# Altium project PCB_Project.PrjPcb
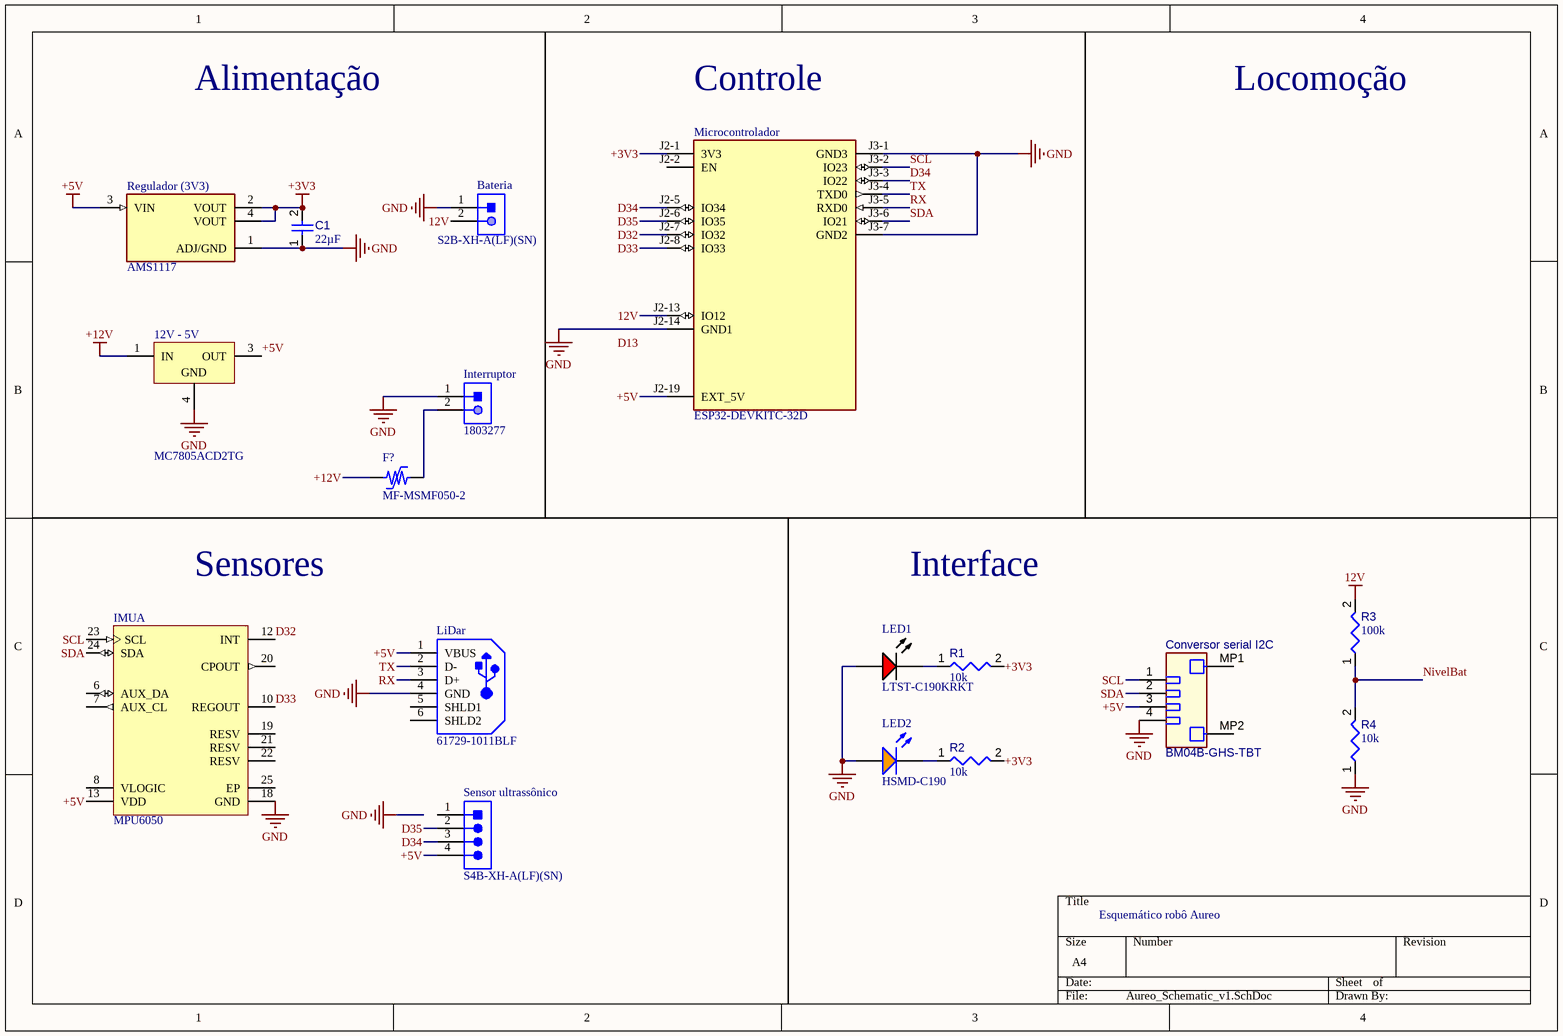
[diagram p0: Aureo_Schematic_v1.SchDoc]
1 sheet, 17 parts. Net scope: global (net labels, ports and power ports of the same name join across sheets).
Board file: Aureo_PCB.PcbDoc

## Sheet Aureo_Schematic_v1.SchDoc
size A4; SheetNumber: 1; SheetTotal: 1

### Parts
12V_-_5V  MC7805ACD2TG  [ONSC-D2PAK-3-936-03_V]
Bateria  S2B-XH-A(LF)(SN)  [JST-S2B-XH-A(LF)(SN)_V]
C1  value 22µF  [CAPC0805(2012)145_L]  (hidden comment: Capacitor 22µF +/-40% 16V 0805)
Conversor_serial_I2C  BM04B-GHS-TBT  [JST-BM04B-GHS-TBT_V]
IMU  MPU6050  [INSE-QFN-24_V]  (part A of 2)
Interruptor  1803277  [PHOE-1803277_V]
LED1  LTST-C190KRKT  [LTST-C191KRKT_V]
LED2  HSMD-C190  [AVAG-HSMX-C190_V]
LiDar  61729-1011BLF  [FCI-61729-1011BLF_V]
Microcontrolador  ESP32-DEVKITC-32D  [MODULE_ESP32-DEVKITC-32D]
R1  value 10k  [RESC1005X40X25ML05T05]  (hidden comment: Resistor 10k +/-1% 0402 100 mW)
R2  value 10k  [RESC1005X40X25ML05T05]  (hidden comment: Resistor 10k +/-1% 0402 100 mW)
R3  value 100k  [RESC1005X40X25ML05T05]  (hidden comment: Resistor 10k +/-1% 0402 100 mW)
R4  value 10k  [RESC1005X40X25ML05T05]  (hidden comment: Resistor 10k +/-1% 0402 100 mW)
Regulador_(3V3)  AMS1117  [SOT229P700X180-4N]
Sensor  MF-MSMF050-2  [BOUR-MF-MSMF050-2_V]
Sensor_ultrassônico  S4B-XH-A(LF)(SN)  [JST-S4B-XH-A(LF)(SN)_V]

### Nets
12V: Bateria.2 Microcontrolador.J2-13(IO12) R3.2
+3V3: C1.2 Microcontrolador.J2-1(3V3) R1.2 R2.2 Regulador_(3V3).2(VOUT) Regulador_(3V3).4(VOUT)
+5V: 12V_-_5V.3(OUT) Conversor_serial_I2C.3 IMU.13(VDD) LiDar.1(VBUS) Microcontrolador.J2-19(EXT_5V) Regulador_(3V3).3(VIN) Sensor_ultrassônico.4
+12V: 12V_-_5V.1(IN) Sensor.1
GND: 12V_-_5V.4(GND) Bateria.1 C1.1 Conversor_serial_I2C.4 IMU.18(GND) Interruptor.1 LED1.1(A) LED2.1(A) LiDar.4(GND) Microcontrolador.J2-14(GND1) Microcontrolador.J3-1(GND3) Microcontrolador.J3-7(GND2) R4.1 Regulador_(3V3).1(ADJ/GND)
D32: IMU.12(INT) Microcontrolador.J2-7(IO32)
D33: IMU.10(REGOUT) Microcontrolador.J2-8(IO33)
D34: Microcontrolador.J2-5(IO34) Microcontrolador.J3-3(IO22) Sensor_ultrassônico.3
D35: Microcontrolador.J2-6(IO35) Sensor_ultrassônico.2
NivelBat: R3.1 R4.2
RX: LiDar.3(D+) Microcontrolador.J3-5(RXD0)
SCL: Conversor_serial_I2C.1 IMU.23(SCL) Microcontrolador.J3-2(IO23)
SDA: Conversor_serial_I2C.2 IMU.24(SDA) Microcontrolador.J3-6(IO21)
TX: LiDar.2(D-) Microcontrolador.J3-4(TXD0)
NetInterruptor_2: Interruptor.2 Sensor.2
NetLED1_2: LED1.2(K) R1.1
NetLED2_2: LED2.2(K) R2.1

Not connected (* = marked no-connect by the designer): Conversor_serial_I2C MP1 MP2; IMU 6(AUX_DA) 7(AUX_CL) 8(VLOGIC) 19(RESV) 20(CPOUT) 21(RESV) 22(RESV) 25(EP); LiDar 5(SHLD1) 6(SHLD2); Microcontrolador J2-2(EN) J2-3(SENSOR_VP) J2-4(SENSOR_VN) J2-9(IO25) J2-10(IO26) J2-11(IO27) J2-12(IO14) J2-15(IO13) J2-16(SD2) J2-17(SD3) J2-18(CMD) J3-8(IO19) J3-9(IO18) J3-10(IO5) J3-11(IO17) J3-12(IO16) J3-13(IO4) J3-14(IO0) J3-15(IO2) J3-16(IO15) J3-17(SD1) J3-18(SD0) J3-19(CLK); Sensor_ultrassônico 1

### Notes on the sheet
- Alimentação
- Controle
- Locomoção
- Sensores
- Interface
- Esquemático robô Aureo
- Labels drawn without touching a wire or pin: D13

### Library data of the parts
12V_-_5V = CMP-019-00027-3: Positive Voltage Regulator, 5 V Output Voltage, 1 A, 0 to 125 degC, 3-Pin D2PAK (936-03), Pb-Free, Tube; Manufacturer: ON Semiconductor; Min Input Voltage: 7V; Package Version: Rev. E, 09/2015; Output Voltage: 5V; Outputs: 1; Max Input Voltage: 35V; Output Current: 1A; Dropout Voltage: 2V; Mounting Technology: SM; Package Quantity: 50; Manufacturer URL: http://www.onsemi.com/; Package Reference: D2PAK-3-936-03; Nominal Output Voltage: 5V; Packaging: Rail/Tube; Max Operating Temperature: 125°C; Datasheet URL: http://www.onsemi.com/pub_link/Collateral/MC7800-D.PDF; RoHS Compliant: True; Datasheet Version: Rev. 27, 11/2014; Case/Package: TO-263-3; Min Operating Temperature: 0°C; Max Ouput Current: 1A; Package Description: 3-Pin Flange Mount, Body 10.02 x 9.1945 mm, Pitch 2.54 mm; Package URL: http://www.onsemi.com/pub_link/Collateral/936-03.PDF; Pins: 3
Bateria = CMP-002-00032-2: Male Header, Pitch 2.5 mm, 1 x 2 Position, Height 6.1 mm, Tail Length 3.4 mm, -25 to 85 degC, RoHS, Bulk; Manufacturer: JST; Case/Package: S2B-XH-A(LF)(SN); Package Description: XH Series Disconnectable Crimp Style Connector, Pitch 2.5 mm, 1 x 2 Position, Height 6.1 mm, Tail Length 3.4 mm; Manufacturer URL: http://www.jst.com/home2.html; Datasheet URL: http://www.jst-mfg.com/product/pdf/eng/eXH.pdf; Connector Type: Header; Package Reference: S2B-XH-A(LF)(SN); Mounting Technology: TH; Max Operating Temperature: 85°C; Min Operating Temperature: -25°C; Datasheet Version: May-16; Gender: Male; RoHS Compliant: Unknown
C1 = CMP-001-00081-4: Chip Capacitor, 22µF +/-40%, 16V, 0805, Thickness 1.45 mm; Tolerance: 5%; Voltage Rating: 16V; Mounting Technology: SMT; Pins: 2; Max Operating Temperature: 85°C; Case/Package: 0805; Min Operating Temperature: -55°C
Conversor_serial_I2C = CMP-002-00053-3: Header, Pitch 1.25 mm, 1 x 4 Position, Height 4.05 mm, -25 to 85 degC; Pins: 6
IMU = CMP-010-00014-3: 3-Axis Gyroscope, 3-Axis Accelerometer, 2.375 to 3.46 V, -40 to 105 degC, 24-Pin QFN, RoHS, Tape and Reel; Manufacturer: InvenSense; Max Supply Voltage: 3.6V; Min Supply Voltage: 2.5V; Sensor Type: Motion; Interface: I2C; Min Operating Temperature: -40°C; Case/Package: QFN; Package Quantity: 5000; Pins: 24; RoHS Compliant: True; Packaging: CutTape; Datasheet URL: https://datasheet.ciiva.com/1513/1788002-1513632.pdf; Package Reference: QFN-24; Datasheet Version: Rev. 3.4, 08/2013; Package Description: 24-Pin Quad Flat No-lead Package, Body 4 x 4 mm, Pitch 0.5 mm; Max Operating Temperature: 85°C; Mounting Technology: SM
Interruptor = CMP-002-00014-2: Male Header, Pitch 3.81 mm, 1 x 2 Position, Height 7.25 mm, Tail Length 3.4 mm, RoHS, Bulk; Manufacturer: Phoenix Contact; Voltage Rating: 160V; Current Rating: 8A; Rows: 1; Mounting Technology: TH; Contact Plating: Tin; Case/Package: 1803277; Gender: Male; Diameter: 7.25mm; Datasheet Version: Feb-14; Colour: Green; Pins: 2; Lead Pitch: 0.15inch; Connector Type: Header; Package Quantity: 50; Max Current Rating: 8A; Manufacturer URL: http://www.phoenixcontact.com/; Packaging: Bulk; RoHS Compliant: True; Datasheet URL: https://datasheet.ciiva.com/16096/1803277-16096845.pdf; Package Reference: 1803277; Package Description: Male Header, Pitch 3.81 mm, 1 x 2 Position, Height 7.25 mm, Tail Length 3.4 mm
LED1 = CMP-007-00024-2: LED Uni-Color Red, 62.5 mW, 25 mA, -30 to 85 degC, 2-Pin SMD, RoHS, Tape and Reel; Manufacturer: Lite-On; Power: 75mW; Forward Voltage: 2V; Luminous Intensity: 54mcd; Lens Style: Diffused; Viewing Angle: 130degrees; Forward Current: 20mA; Manufacturer URL: http://www.us.liteon.com/; Case/Package: 0603; Datasheet Version: Rev. F, 05/2013; Package Reference: C191KRKT; Datasheet URL: http://optoelectronics.liteon.com/upload/download/DS-22-99-0151/S_110_LTST-C190KRKT.pdf; Package Description: 2-Pin Surface Mount Device, Body 1.6 x 0.8 mm; Nominal Vf: 2V; Packaging: TapeandReel; RoHS Compliant: True; Pins: 2; Illumination Colour: Red; Colour: Red; Mounting Technology: SM; Package Quantity: 3000; Min Operating Temperature: -55°C; Max Operating Temperature: 85°C
LED2 = CMP-007-00012-2: LED Uni-Color Orange, 52 mW, 20 mA, -40 to 85 degC, 2-Pin SMD, RoHS, Tape and Reel; Manufacturer: Avago; Lens Style: Diffused; Forward Voltage: 2.2V; Forward Current: 20mA; Viewing Angle: 170degrees; Power: 52mW; Luminous Intensity: 8mcd; Min Operating Temperature: -40°C; Packaging: TapeandReel; Colour: Orange; Nominal Vf: 2.2V; Pins: 2; Case/Package: 0603; Max Operating Temperature: 85°C; Illumination Colour: Orange; Package Description: 2-Pin Surface Mount Device, Body 1.6 x 0.8 mm, Height 0.9 mm; Manufacturer URL: http://www.avagotech.com/; Datasheet Version: Mar-12; RoHS Compliant: True; Datasheet URL: http://docs.avagotech.com/docs/AV02-0551EN; Mounting Technology: SM; Package Reference: HSMX-C190; Package Quantity: 4000
LiDar = CMP-002-00041-2: USB Receptacle B Type, Right Angle, 4 Position, Height 11.5 mm,-40 to 85 degC, RoHS, Tube; Manufacturer: FCI Electronics; Current Rating: 1.5A; Gender: Female; Contact Material: Copper; Contact Plating: Nickel; Colour: Black; Max Operating Temperature: 40°C; Datasheet URL: http://portal.fciconnect.com/Comergent/fci/drawing/61729.pdf; Pins: 4; Lead Pitch: 2.5mm; Mounting Technology: TH; Packaging: Rail/Tube; Package Description: 4-Pin Through Hole Device, Body 16 x 12.2 mm; RoHS Compliant: True; Case/Package: 61729-1011BLF; Package Quantity: 44; Manufacturer URL: http://portal.fciconnect.com/; Package Reference: 61729-1011BLF; Datasheet Version: Rev. W, 05/2014; Connector Type: USB; Min Operating Temperature: 0°C
Microcontrolador = ESP32-DEVKITC-32D: WiFi Development Tools (802.11) ESP32 General Development Kit, ESP32-WROOM-32D on the board; MF: Espressif Systems; SnapEDA_Link: https://www.snapeda.com/parts/ESP32-DEVKITC-32D/Espressif+Systems/view-part/?ref=snap; Package: None; Value: *; MP: ESP32-DEVKITC-32D; Check_prices: https://www.snapeda.com/parts/ESP32-DEVKITC-32D/Espressif+Systems/view-part/?ref=eda
R1-R4 = CMP-009-00015-5: Chip Resistor, 10 KOhm, +/- 1%, 0.1 W, -55 to 155 degC, 0402 (1005 Metric); Voltage Rating: 50V; Power: 100mW; Case/Package: 0402; RoHS Compliant: True; Min Operating Temperature: -55°C; Mounting Technology: SM; Tolerance: 1%; Max Operating Temperature: 155°C; Pins: 2
Regulador_(3V3) = AMS1117: 1A LOW DROPOUT VOLTAGE REGULATOR SOT-223; MF: Advanced Monolithic Systems; Price: None; Availability: Not in stock; Package: SOT-223 Seeed Technology; MP: AMS1117; Value: *; SnapEDA_Link: https://www.snapeda.com/parts/AMS1117/Advanced+Monolithic+Systems/view-part/?ref=snap; Check_prices: https://www.snapeda.com/parts/AMS1117/Advanced+Monolithic+Systems/view-part/?ref=eda
Sensor = CMP-005-00001-4: PTC Resettable Fuse, 15 V, 500 mA, -40 to 85 degC, 2-Pin SMD, RoHS, Tape and Reel; Manufacturer: Bourns; Nominal Supply Voltage: 15V; Current Rating: 100A; Resistance: 150mohm
Sensor_ultrassônico = CMP-002-00034-2: Male Header, Pitch 2.5 mm, 1 x 4 Position, Height 6.1 mm, Tail Length 3.4 mm, -25 to 85 degC, RoHS, Bulk; Manufacturer: JST; Manufacturer URL: http://www.jst.com/home2.html; RoHS Compliant: Unknown; Gender: Male; Min Operating Temperature: -25°C; Datasheet URL: http://www.jst-mfg.com/product/pdf/eng/eXH.pdf; Case/Package: S4B-XH-A(LF)(SN); Datasheet Version: May-16; Mounting Technology: TH; Package Reference: S4B-XH-A(LF)(SN); Max Operating Temperature: 85°C; Package Description: XH Series Disconnectable Crimp Style Connector, Pitch 2.5 mm, 1 x 4 Position, Height 6.1 mm, Tail Length 3.4 mm; Connector Type: Header